# Altium schematic sheet SWatch_Schematic_2.SchDoc
size A4
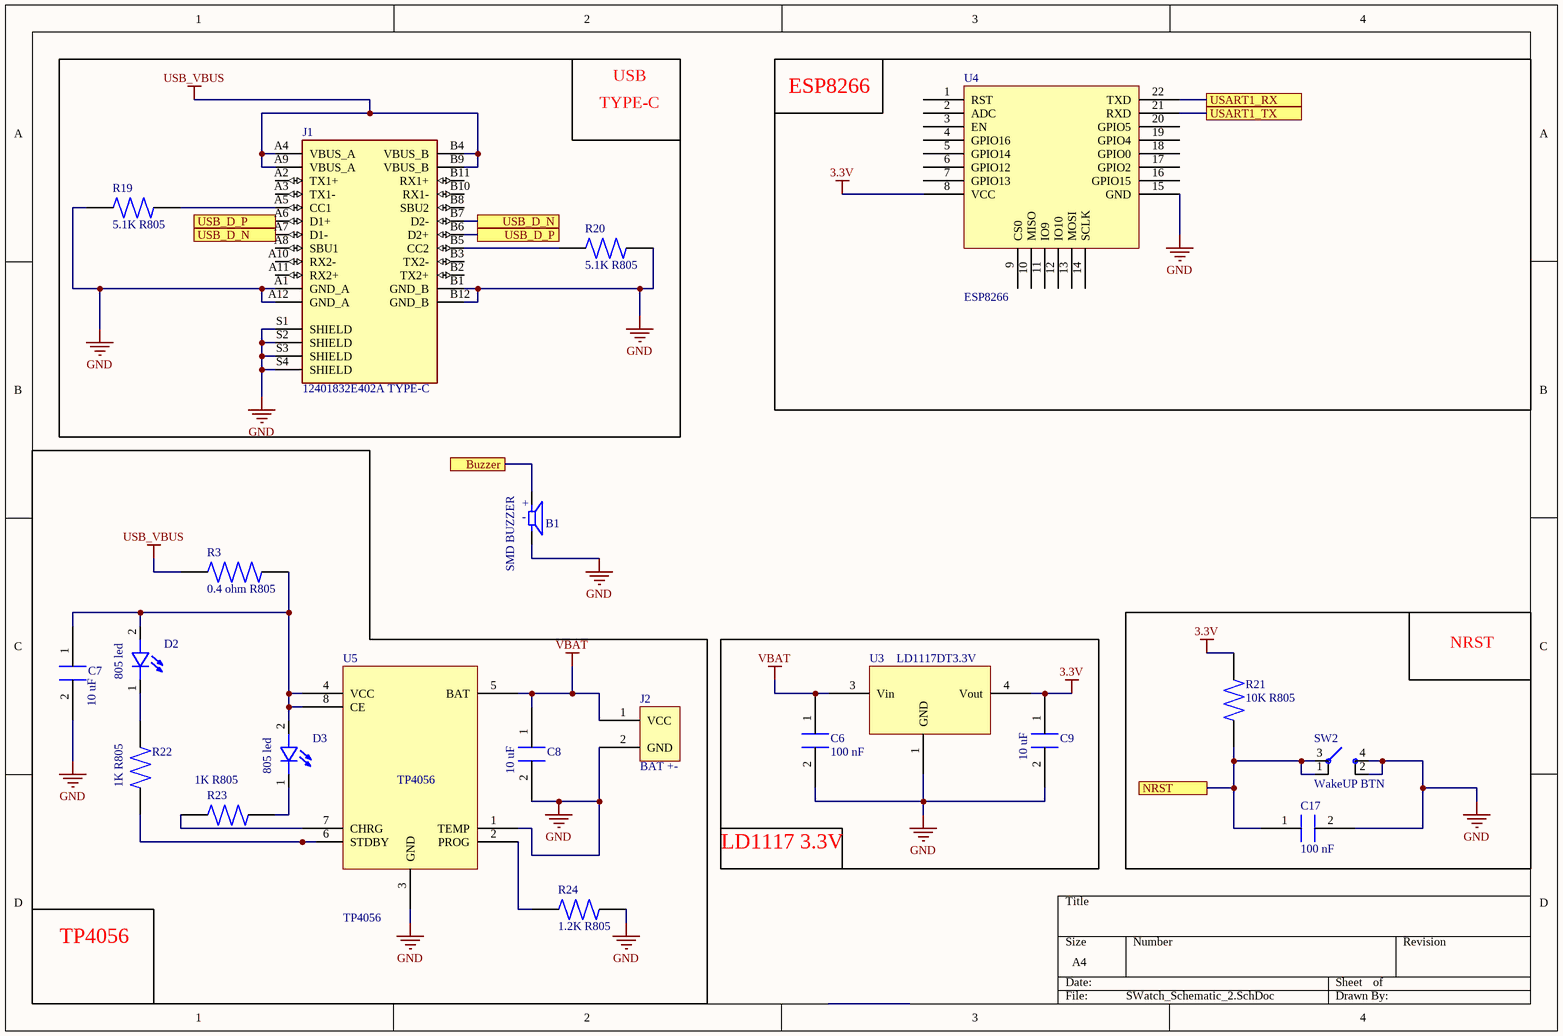
[diagram p0: SWatch_Schematic_2.SchDoc]

## Parts
B1  SMD BUZZER  [SMD BUZZER]
C6  100 nF  [100 nF C805]
C7  10 uF  [10uF C805]
C8  10 uF  [10uF C805]
C9  10 uF  [10uF C805]
C17  100 nF  [100 nF C805]
D2  805 led  [led]
D3  805 led  [led]
J1  12401832E402A TYPE-C  [12401832E402A TYPE-C]
J2  BAT +-  [BAT -+]
R3  0.4 ohm R805  [1K R805]
R19  5.1K R805  [1K R805]
R20  5.1K R805  [1K R805]
R21  10K R805  [10K R805]
R22  1K R805  [1K R805]
R23  1K R805  [1K R805]
R24  1.2K R805  [1.2K R805]
SW2  WakeUP BTN  [WakeUp BTN]
U3  LD1117DT3.3V  [LD1117DT3.3V]
U4  ESP8266  [ESP8266]
U5  TP4056  [TP4056]

## Blocks framed on the sheet
ESP8266: U4
TP4056: C7 C8 D2 D3 J2 R3 R22-R24 U5
NRST: C17 R21 SW2
LD1117 3.3V: C6 C9 U3

## Ports
  Buzzer, NRST, USART1_RX, USART1_TX, USB_D_N, USB_D_P

## Nets
3.3V: C9.1 R21.1 U3.4(Vout) U4.8(VCC)
GND: B1.2(N) C6.2 C7.2 C8.2 C9.2 C17.2 J1.A1(GND_A) J1.A12(GND_A) J1.B1(GND_B) J1.B12(GND_B) J1.S1(SHIELD) J1.S2(SHIELD) J1.S3(SHIELD) J1.S4(SHIELD) J2.2(GND) R19.1 R20.2 R24.2 SW2.2 SW2.4 U3.1(GND) U4.15(GND) U5.1(TEMP) U5.3(GND)
USB_VBUS: J1.A4(VBUS_A) J1.A9(VBUS_A) J1.B4(VBUS_B) J1.B9(VBUS_B) R3.2
VBAT: C6.1 C8.1 J2.1(VCC) U3.3(Vin) U5.5(BAT)
  Buzzer: B1.1(P) ; port   Buzzer
NRST: C17.1 R21.2 SW2.1 SW2.3 ; port NRST
USART1_RX: U4.22(TXD) ; port USART1_RX
USART1_TX: U4.21(RXD) ; port USART1_TX
USB_D_N: J1.A7(D1-) J1.B7(D2-) ; port USB_D_N
USB_D_P: J1.A6(D1+) J1.B6(D2+) ; port USB_D_P
NetC7_1: C7.1 D2.2(A) D3.2(A) R3.1 U5.4(VCC) U5.8(CE)
NetD2_1: D2.1(C) R22.2
NetD3_1: D3.1(C) R23.2
NetJ1_A5: J1.A5(CC1) R19.2
NetJ1_B5: J1.B5(CC2) R20.1
NetR22_1: R22.1 U5.6(STDBY)
NetR23_1: R23.1 U5.7(CHRG)
NetR24_1: R24.1 U5.2(PROG)

Not connected (* = marked no-connect by the designer): J1 A2(TX1+) A3(TX1-) A8(SBU1) A10(RX2-) A11(RX2+) B2(TX2+) B3(TX2-) B8(SBU2) B10(RX1-) B11(RX1+); U4 1(RST) 2(ADC) 3(EN) 4(GPIO16) 5(GPIO14) 6(GPIO12) 7(GPIO13) 9(CS0) 10(MISO) 11(IO9) 12(IO10) 13(MOSI) 14(SCLK) 16(GPIO15) 17(GPIO2) 18(GPIO0) 19(GPIO4) 20(GPIO5)

## Notes on the sheet
- TYPE-C
- USB
- (in symbol SMD BUZZER) +; -

## Library data of the parts
B1 = SMD BUZZER: PKMCS0909E4000-R1